# Altium schematic sheet 5V_Supply.SchDoc
size A
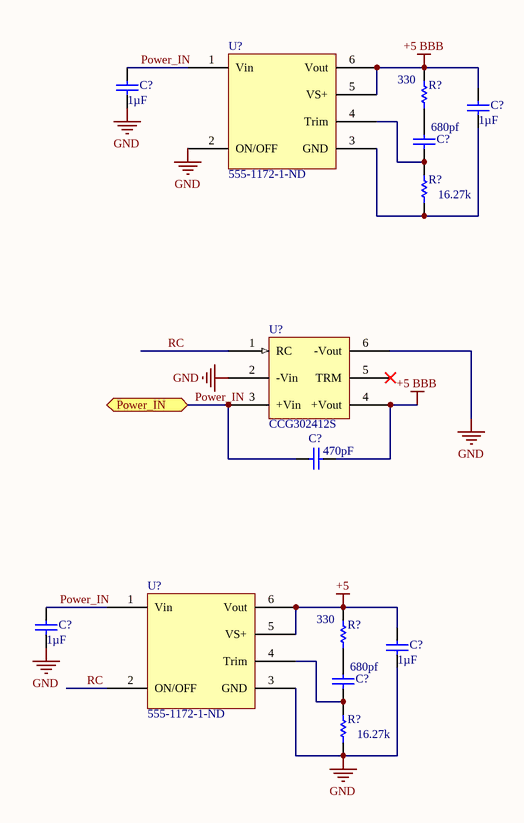
[diagram p0: 5V_Supply.SchDoc]

## Parts
(Parts that share a designator on the sheet are numbered #1, #2 ... from top to bottom, then left to right.)
C?#1  Capacitance: 1µF  [CAPC1206(3216)130_N]  (hidden comment: CAP CER 1UF 50V X7R 1210)
C?#2  Capacitance: 1µF  [CAPC1206(3216)130_N]  (hidden comment: CAP CER 1UF 50V X7R 1210)
C?#3  Capacitance: 680pf  [CAPC1206(3216)130_N]  (hidden comment: CAP CER 1UF 50V X7R 1210)
C?#4  Capacitance: 470pF  [CAPC1812(4532)230_M]  (hidden comment: CAP CER 470PF 3KV X7R 1812)
C?#5  Capacitance: 1µF  [CAPC1206(3216)130_N]  (hidden comment: CAP CER 1UF 50V X7R 1210)
C?#6  Capacitance: 1µF  [CAPC1206(3216)130_N]  (hidden comment: CAP CER 1UF 50V X7R 1210)
C?#7  Capacitance: 680pf  [CAPC1206(3216)130_N]  (hidden comment: CAP CER 1UF 50V X7R 1210)
R?#1  330  [RESC0402(1005)_L]
R?#2  16.27k  [RESC0402(1005)_L]
R?#3  330  [RESC0402(1005)_L]
R?#4  16.27k  [RESC0402(1005)_L]
U?#1  Supplier Part Number 1: 555-1172-1-ND  [APXW005A0X3-SRZ]  (hidden comment: APXW005A0X3-SRZ)
U?#2  CCG302412S  [CCG30]
U?#3  Supplier Part Number 1: 555-1172-1-ND  [APXW005A0X3-SRZ]  (hidden comment: APXW005A0X3-SRZ)

## Ports
Power_IN

## Nets
+5: C?#6.2 R?#3.2 U?#3.5(VS+) U?#3.6(Vout)
+5 BBB: C?#2.2 C?#4.2 R?#1.2 U?#1.5(VS+) U?#1.6(Vout) U?#2.4(+Vout)
GND: C?#1.1 C?#5.1 C?#6.1 R?#4.1 U?#1.2(ON/OFF) U?#2.2(-Vin) U?#2.6(-Vout) U?#3.3(GND)
Power_IN: C?#1.2 C?#4.1 C?#5.2 U?#1.1(Vin) U?#2.3(+Vin) U?#3.1(Vin) ; port Power_IN
RC: U?#2.1(RC) U?#3.2(ON/OFF)
NetC?#2_1: C?#2.1 R?#2.1 U?#1.3(GND)
NetC?#3_1: C?#3.1 R?#2.2 U?#1.4(Trim)
NetC?#3_2: C?#3.2 R?#1.1
NetC?#7_1: C?#7.1 R?#4.2 U?#3.4(Trim)
NetC?#7_2: C?#7.2 R?#3.1

Not connected (* = marked no-connect by the designer): U?#2 5(TRM)*

## Library data of the parts
C?#1-C?#3 C?#5-C?#7 = CMP-1037-04913-1: Manufacturer: Murata Electronics North America; Manufacturer Part Number: GRM32RR71H105KA01L; Tolerance: ±10%; Supplier 1: Digi-Key; Supplier Part Number 1: 490-1863-6-ND; RoHS: RoHS Compliant; Category: Capacitors; Stock 1: 66890; Pricing 1: 1=0.35, 10=0.242, 100=0.1449, 500=0.10868 (USD); Packaging: Digi-Reel®; Part Status: Active; Voltage - Rated: 50V; Temperature Coefficient: X7R; Operating Temperature: -55°C ~ 125°C; Features: -; Ratings: -; Applications: General Purpose; Mounting Type: Surface Mount, MLCC; Package / Case: 1210 (3225 Metric); Size / Dimension: 0.126" L x 0.098" W (3.20mm x 2.50mm); Height - Seated (Max): -; Thickness (Max): 0.079" (2.00mm); Lead Spacing: -; Lead Style: -; ComponentLink1URL: http://search.murata.co.jp/Ceramy/image/img/A01X/G101/ENG/GRM32RR71H105KA01-01.pdf; ComponentLink1Description: http://search.murata.co.jp/Ceramy/image/img/A01X/G101/ENG/GRM32RR71H105KA01-01.pdf
C?#4 = CMP-1040-00561-1: Manufacturer: Kemet; Manufacturer Part Number: C1812C471KHRACTU; Tolerance: 10%; Supplier 1: Digi-Key; Supplier Part Number 1: 399-7289-6-ND; Stock 1: 2705; Pricing 1: 1=0.88, 10=0.666, 100=0.4761 (USD); Case/Package: 1812; Case Code (Metric): 4532; Case Code (Imperial): 1812; Min Operating Temperature: -55°C; Max Operating Temperature: 125°C; Voltage Rating: 3kV; Packaging: Tape and Reel; Package Quantity: 1; Voltage Rating (DC): 3kV; Length: 0.177inch; Width: 0.126inch; Thickness: 0.071inch; Lead Free: Lead Free; ComponentLink1URL: http://www.kemet.com/docfinder?Partnumber=C1812C471KHRACTU; ComponentLink1Description: http://www.kemet.com/docfinder?Partnumber=C1812C471KHRACTU
R?#1-R?#4 = CMP-1011-00927-1: TBD; Tolerance: ±1%; Temperature Coefficient: ±100ppm/°C; Supplier Part Number 1: YAG3220CT-ND; Supplier Device Package: 0402
U?#1 U?#3 = APXW005A0X3-SRZ: Manufacturer: GE Critical Power; Voltage - Input (Min): 9V; Voltage - Input (Max): 36V; Voltage - Output 1: 3 ~ 18 V; Current - Output (Max): 5A; Efficiency: 95.9%; Control Features: Enable, Active Low; Supplier 1: Digi-Key; Manufacturer Part Number: APXW005A0X3-SRZ; RoHS: RoHS Compliant; Category: Power Supplies - Board Mount; Stock 1: 3316; Pricing 1: 1=15.12, 5=15.01, 10=14.896, 25=14.6664, 50=14.208, 100=12.8331 (USD); Packaging: Cut Tape (CT); Part Status: Active; Type: Non-Isolated PoL Module; Voltage - Output 2: -; Voltage - Output 3: -; Applications: ITE (Commercial); Features: Remote On/Off, OCP, OTP, UVLO; Operating Temperature: -40°C ~ 85°C; Mounting Type: Surface Mount; Package / Case: 6-SMD Module; Size / Dimension: 0.80" L x 0.45" W x 0.34" H (20.3mm x 11.4mm x 8.5mm); ComponentLink1URL: http://apps.geindustrial.com/publibrary/checkout/APXW005A0X?TNR=Data%20Sheets%7CAPXW005A0X%7Cgeneric; ComponentLink1Description: http://apps.geindustrial.com/publibrary/checkout/APXW005A0X?TNR=Data%20Sheets%7CAPXW005A0X%7Cgeneric
U?#2 = CCG302412S: DC/DC CONVERTER 12V 2.5A PCB; Power (Watts) - Manufacture Series: 30W; Manufacturer 1: TDK-Lambda Americas Inc; Number of Outputs: 1; Voltage - Input (Min): 9V; Voltage - Input (Max): 36V; Voltage - Isolation: 1.5kV (1500V); Efficiency: 89%; Category 1: Power Supplies - Board Mount; Packaging: Tube; Type: Isolated Module; Voltage - Output 1: 12V; Voltage - Output 2: -; Voltage - Output 3: -; Current - Output (Max): 2.5A; Features: Remote On/Off, OCP; Mounting Type: Through Hole; Package / Case: 6-DIP Module (6 Leads); Size / Dimension: 1.00" L x 1.00" W x 0.39" H (25.4mm x 25.4mm x 9.9mm); Operating Temperature: -40°C ~ 85°C; Power (Watts) - Max: 30W; ComponentLink1URL: http://www.us.tdk-lambda.com/ftp/specs/ccg30.pdf; ComponentLink1Description: http://www.us.tdk-lambda.com/ftp/specs/ccg30.pdf; Supplier 1: Digi-Key; Supplier Part Number 1: 285-2419-ND; Manufacturer Part Number 1: CCG302412S; RoHS 1: RoHS Compliant; Description 1: DC/DC CONVERTER 12V 2.5A PCB; Stock 1: 30; Pricing 1: 1=43.63, 10=42.95 (USD)